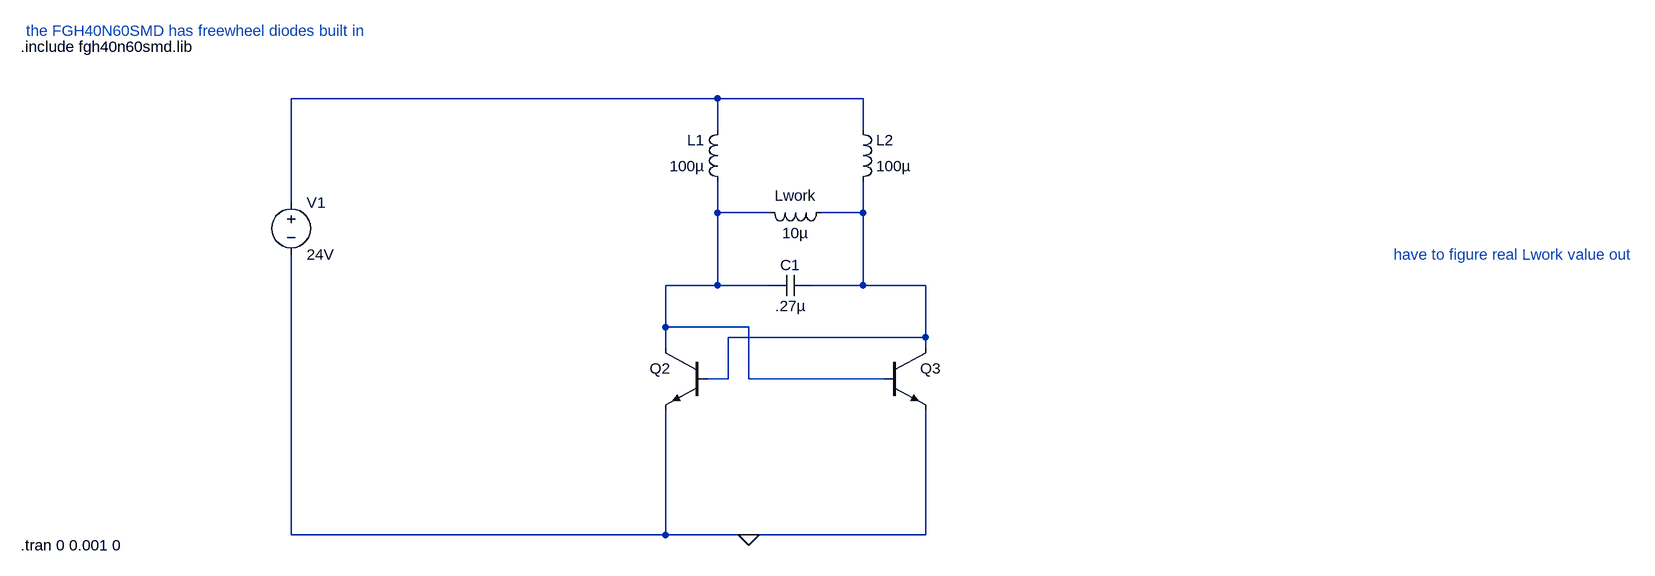
[diagram p0: schematic halfbridge.asc]
halfbridge.asc, the LTspice schematic file:
Version 4.1
SHEET 1 2356 784
WIRE 896 80 240 80
WIRE 1120 80 896 80
WIRE 896 128 896 80
WIRE 1120 128 1120 80
WIRE 240 240 240 80
WIRE 896 256 896 208
WIRE 976 256 896 256
WIRE 1120 256 1120 208
WIRE 1120 256 1056 256
WIRE 896 368 896 256
WIRE 896 368 816 368
WIRE 976 368 896 368
WIRE 1120 368 1120 256
WIRE 1120 368 1040 368
WIRE 1216 368 1120 368
WIRE 816 432 816 368
WIRE 944 432 816 432
WIRE 1216 448 1216 368
WIRE 1216 448 912 448
WIRE 816 464 816 432
WIRE 1216 464 1216 448
WIRE 912 512 912 448
WIRE 912 512 880 512
WIRE 944 512 944 432
WIRE 1152 512 944 512
WIRE 240 752 240 320
WIRE 816 752 816 560
WIRE 816 752 240 752
WIRE 944 752 816 752
WIRE 1216 752 1216 560
WIRE 1216 752 944 752
FLAG 944 752 0
SYMBOL voltage 240 224 R0
WINDOW 123 0 0 Left 0
WINDOW 39 0 0 Left 0
SYMATTR InstName V1
SYMATTR Value 24V
SYMBOL ind 912 224 R180
WINDOW 0 36 80 Left 2
WINDOW 3 36 40 Left 2
SYMATTR InstName L1
SYMATTR Value 100µ
SYMATTR SpiceLine Rser=1m
SYMBOL cap 1040 352 R90
WINDOW 0 0 32 VBottom 2
WINDOW 3 32 32 VTop 2
SYMATTR InstName C1
SYMATTR Value .27µ
SYMBOL ind 1072 240 R90
WINDOW 0 5 56 VBottom 2
WINDOW 3 32 56 VTop 2
SYMATTR InstName Lwork
SYMATTR Value 10µ
SYMATTR SpiceLine Rser=1m
SYMBOL ind 1104 224 M180
WINDOW 0 36 80 Left 2
WINDOW 3 36 40 Left 2
SYMATTR InstName L2
SYMATTR Value 100µ
SYMATTR SpiceLine Rser=1m
SYMBOL npn 880 464 M0
SYMATTR InstName Q2
SYMATTR Value ""
SYMATTR Prefix X
SYMATTR SpiceModel FGH40N60SMD
SYMBOL npn 1152 464 R0
SYMATTR InstName Q3
SYMATTR Value ""
SYMATTR Prefix X
SYMATTR SpiceModel FGH40N60SMD
TEXT -176 0 Left 2 !.include fgh40n60smd.lib
TEXT -168 -24 Left 2 ;the FGH40N60SMD has freewheel diodes built in
TEXT 1936 320 Left 2 ;have to figure real Lwork value out
TEXT -176 768 Left 2 !.tran 0 0.001 0

The netlist it stands for:
* halfbridge.asc
V1 N001 0 24V
L1 N002 N001 100µ Rser=1m
C1 N003 N002 .27µ
Lwork N003 N002 10µ Rser=1m
L2 N003 N001 100µ Rser=1m
X§Q2 N002 N003 0 FGH40N60SMD  ; pins C B E
X§Q3 N003 N002 0 FGH40N60SMD  ; pins C B E
.include fgh40n60smd.lib
* the FGH40N60SMD has freewheel diodes built in
* have to figure real Lwork value out
.tran 0 0.001 0
.backanno
.end